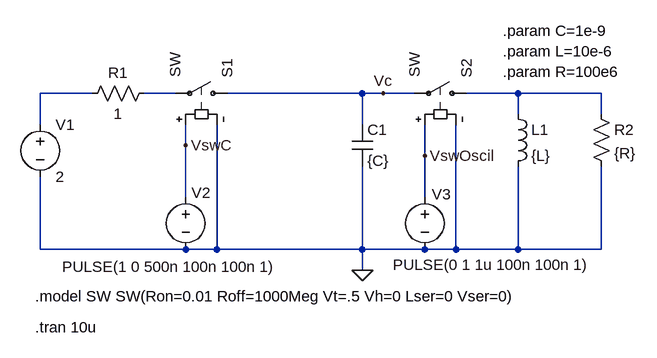
[diagram p0: schematic LCOscillatorVCInitial.asc]
LCOscillatorVCInitial.asc, the LTspice schematic file:
Version 4
SHEET 1 908 680
WIRE -96 96 -176 96
WIRE 32 96 -16 96
WIRE 320 96 112 96
WIRE 352 96 320 96
WIRE 400 96 352 96
WIRE 560 96 480 96
WIRE 688 96 560 96
WIRE 560 128 560 96
WIRE 688 128 688 96
WIRE -176 144 -176 96
WIRE 320 144 320 96
WIRE 48 176 48 144
WIRE 416 192 416 144
WIRE 48 256 48 176
WIRE 416 256 416 192
WIRE -176 336 -176 224
WIRE 48 336 -176 336
WIRE 96 336 96 144
WIRE 96 336 48 336
WIRE 320 336 320 208
WIRE 320 336 96 336
WIRE 416 336 320 336
WIRE 464 336 464 144
WIRE 464 336 416 336
WIRE 560 336 560 208
WIRE 560 336 464 336
WIRE 688 336 688 208
WIRE 688 336 560 336
WIRE 320 368 320 336
FLAG 320 368 0
FLAG 352 96 Vc
FLAG 48 176 VswC
FLAG 416 192 VswOscil
SYMBOL voltage -176 128 R0
WINDOW 123 0 0 Left 2
WINDOW 39 0 0 Left 2
SYMATTR InstName V1
SYMATTR Value 2
SYMBOL res -112 112 R270
WINDOW 0 32 56 VTop 2
WINDOW 3 0 56 VBottom 2
SYMATTR InstName R1
SYMATTR Value 1
SYMBOL cap 304 144 R0
SYMATTR InstName C1
SYMATTR Value {C}
SYMBOL ind 544 112 R0
SYMATTR InstName L1
SYMATTR Value {L}
SYMBOL res 672 112 R0
SYMATTR InstName R2
SYMATTR Value {R}
SYMBOL sw 128 96 M270
SYMATTR InstName S1
SYMBOL sw 496 96 M270
SYMATTR InstName S2
SYMBOL voltage 48 240 R0
WINDOW 3 -190 123 Left 2
WINDOW 123 0 0 Left 2
WINDOW 39 0 0 Left 2
WINDOW 0 9 9 Left 2
SYMATTR Value PULSE(1 0 500n 100n 100n 1)
SYMATTR InstName V2
SYMBOL voltage 416 240 R0
WINDOW 3 -49 120 Left 2
WINDOW 123 0 0 Left 2
WINDOW 39 0 0 Left 2
WINDOW 0 11 11 Left 2
SYMATTR Value PULSE(0 1 1u 100n 100n 1)
SYMATTR InstName V3
TEXT -184 408 Left 2 !.model SW SW(Ron=0.01 Roff=1000Meg Vt=.5 Vh=0 Lser=0 Vser=0)
TEXT -184 456 Left 2 !.tran 10u
TEXT 536 0 Left 2 !.param C=1e-9 \n.param L=10e-6\n.param R=100e6

The netlist it stands for:
* LCOscillatorVCInitial.asc
V1 N001 0 2
R1 N001 N002 1
C1 Vc 0 {C}
L1 N003 0 {L}
R2 N003 0 {R}
S1 Vc N002 VswC 0 SW
S2 N003 Vc VswOscil 0 SW
V2 VswC 0 PULSE(1 0 500n 100n 100n 1)
V3 VswOscil 0 PULSE(0 1 1u 100n 100n 1)
.model SW SW(Ron=0.01 Roff=1000Meg Vt=.5 Vh=0 Lser=0 Vser=0)
.tran 10u
.param C=1e-9
.param L=10e-6
.param R=100e6
.backanno
.end